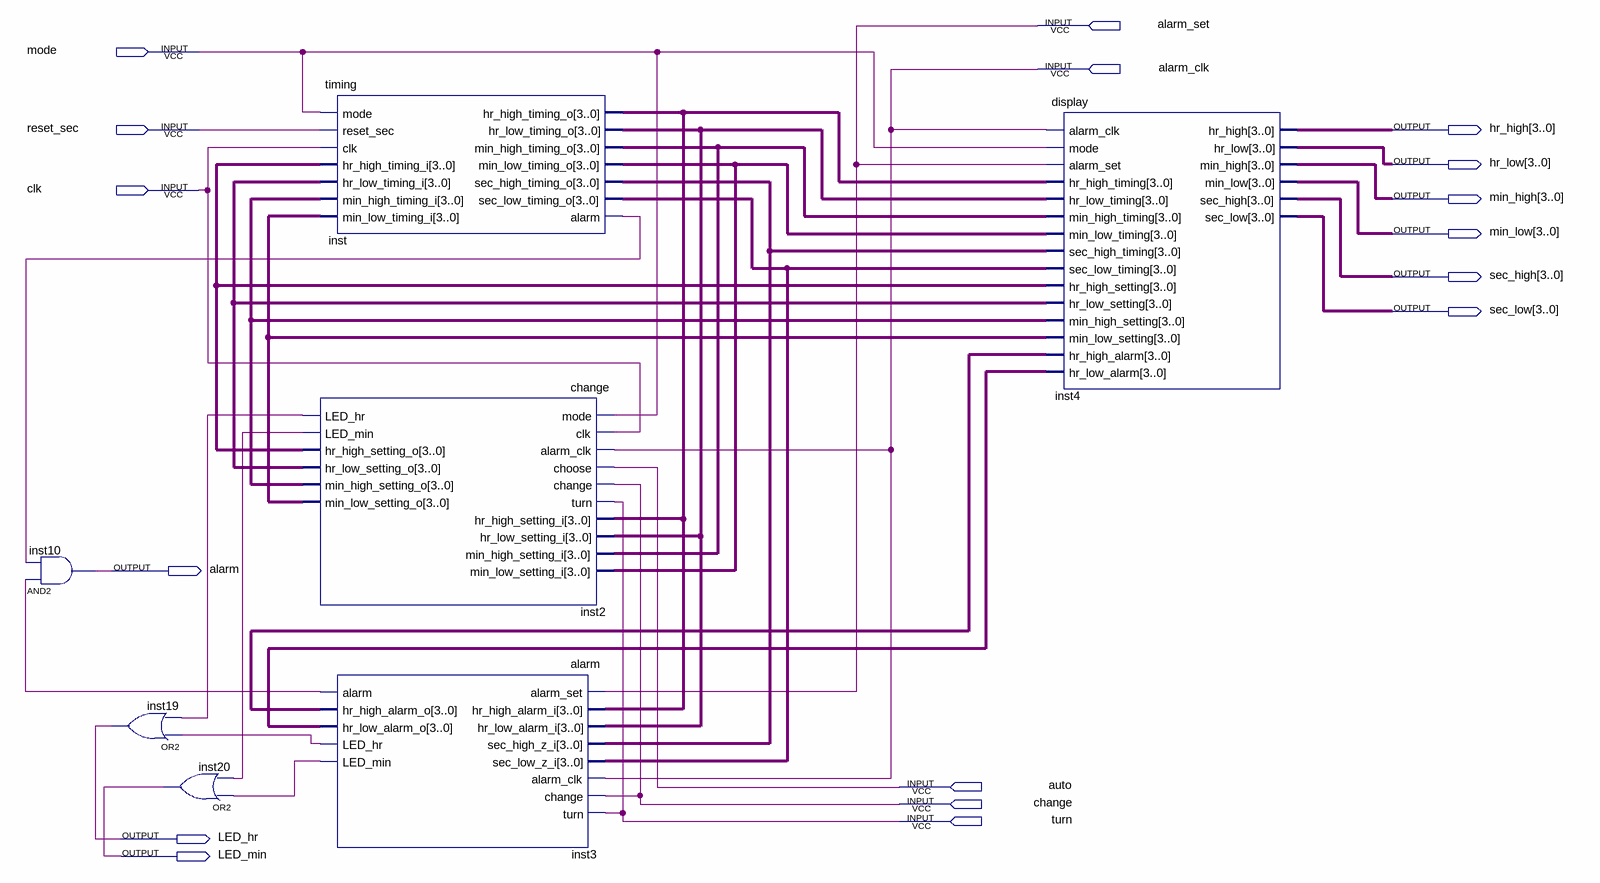
[diagram p0: schematic sheet]
// Quartus schematic clock.bdf as structural Verilog: 7 symbols, 17 pins
module clock (
  input  alarm_set,
  input  mode,
  input  alarm_clk,
  input  reset_sec,
  input  clk,
  input  auto,
  input  change,
  input  turn,
  output [3:0] hr_high,
  output [3:0] hr_low,
  output [3:0] min_high,
  output [3:0] min_low,
  output [3:0] sec_high,
  output [3:0] sec_low,
  output alarm,
  output LED_hr,
  output LED_min
);

  wire inst2_led_hr, inst2_led_min, inst3_alarm, inst3_led_hr, inst3_led_min, inst_alarm;
  wire [3:0] inst2_hr_high_setting_o, inst2_hr_low_setting_o, inst2_min_high_setting_o,
       inst2_min_low_setting_o, inst3_hr_high_alarm_o, inst3_hr_low_alarm_o, inst_hr_high_timing_o,
       inst_hr_low_timing_o, inst_min_high_timing_o, inst_min_low_timing_o, inst_sec_high_timing_o,
       inst_sec_low_timing_o;

  and inst10 (alarm, inst3_alarm, inst_alarm);
  or inst19 (LED_hr, inst3_led_hr, inst2_led_hr);
  or inst20 (LED_min, inst3_led_min, inst2_led_min);
  timing inst (
    .mode(mode), .reset_sec(reset_sec), .clk(clk), .hr_high_timing_i(inst2_hr_high_setting_o),
    .hr_low_timing_i(inst2_hr_low_setting_o), .min_high_timing_i(inst2_min_high_setting_o),
    .min_low_timing_i(inst2_min_low_setting_o), .hr_high_timing_o(inst_hr_high_timing_o),
    .hr_low_timing_o(inst_hr_low_timing_o), .min_high_timing_o(inst_min_high_timing_o),
    .min_low_timing_o(inst_min_low_timing_o), .sec_high_timing_o(inst_sec_high_timing_o),
    .sec_low_timing_o(inst_sec_low_timing_o), .alarm(inst_alarm));
  change inst2 (
    .mode(mode), .clk(clk), .alarm_clk(alarm_clk), .choose(auto), .change(change), .turn(turn),
    .hr_high_setting_i(inst_hr_high_timing_o), .hr_low_setting_i(inst_hr_low_timing_o),
    .min_high_setting_i(inst_min_high_timing_o), .min_low_setting_i(inst_min_low_timing_o),
    .LED_hr(inst2_led_hr), .LED_min(inst2_led_min), .hr_high_setting_o(inst2_hr_high_setting_o),
    .hr_low_setting_o(inst2_hr_low_setting_o), .min_high_setting_o(inst2_min_high_setting_o),
    .min_low_setting_o(inst2_min_low_setting_o));
  alarm inst3 (
    .alarm_set(alarm_set), .hr_high_alarm_i(inst_hr_high_timing_o), .hr_low_alarm_i(inst_hr_low_timing_o),
    .sec_high_z_i(inst_sec_high_timing_o), .sec_low_z_i(inst_sec_low_timing_o), .alarm_clk(alarm_clk),
    .change(change), .turn(turn), .alarm(inst3_alarm), .hr_high_alarm_o(inst3_hr_high_alarm_o),
    .hr_low_alarm_o(inst3_hr_low_alarm_o), .LED_hr(inst3_led_hr), .LED_min(inst3_led_min));
  display inst4 (
    .alarm_clk(alarm_clk), .mode(mode), .alarm_set(alarm_set), .hr_high_timing(inst_hr_high_timing_o),
    .hr_low_timing(inst_hr_low_timing_o), .min_high_timing(inst_min_high_timing_o),
    .min_low_timing(inst_min_low_timing_o), .sec_high_timing(inst_sec_high_timing_o),
    .sec_low_timing(inst_sec_low_timing_o), .hr_high_setting(inst2_hr_high_setting_o),
    .hr_low_setting(inst2_hr_low_setting_o), .min_high_setting(inst2_min_high_setting_o),
    .min_low_setting(inst2_min_low_setting_o), .hr_high_alarm(inst3_hr_high_alarm_o),
    .hr_low_alarm(inst3_hr_low_alarm_o), .hr_high(hr_high), .hr_low(hr_low), .min_high(min_high),
    .min_low(min_low), .sec_high(sec_high), .sec_low(sec_low));
endmodule
